# EAGLE design bisstransceiver (EAGLE 9.6.2)
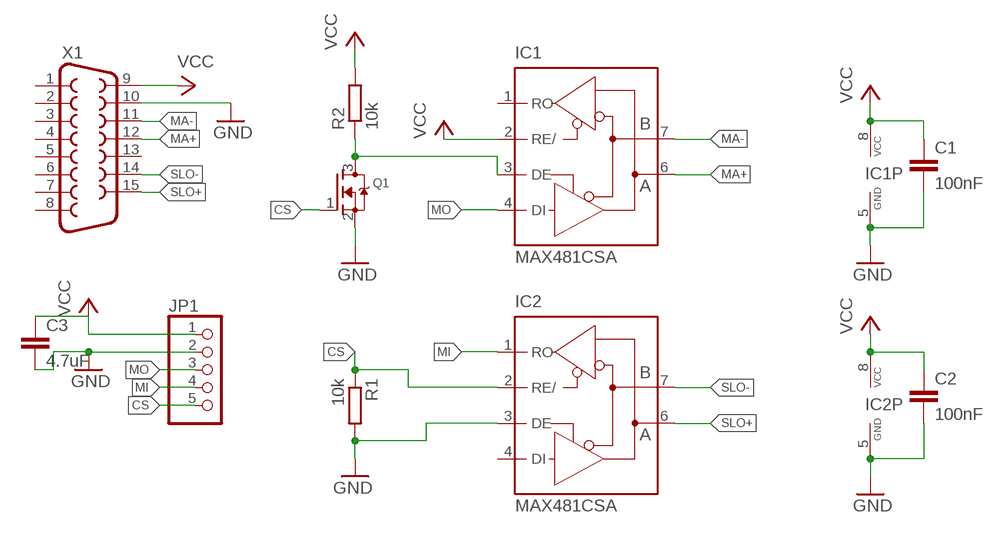
[diagram p0: schematic, sheet 1]

## Parts
C1  100nF  C-EUC0603  [C0603]
C2  100nF  C-EUC0603  [C0603]
C3  4.7uF  C-EUC0603  [C0603]
IC1  MAX481CSA  [SO08]
IC2  MAX481CSA  [SO08]
JP1  PINHD-1X5/90  [1X05/90]
Q1  MOSFET-NREFLOW  [SOT23]
R1  10k  R-EU_R0603  [R0603]
R2  10k  R-EU_R0603  [R0603]
X1  F15HP  [F15HP]

## Nets
CS: IC2.2(RE/) JP1.5 Q1.1(G) R1.1
GND: C1.2 C2.2 C3.2 IC1.5(GND) IC2.3(DE) IC2.5(GND) JP1.2 Q1.2(S) R1.2 X1.10
MA+: IC1.6(A) X1.12
MA-: IC1.7(B) X1.11
MI: IC2.1(RO) JP1.4
MO: IC1.4(DI) JP1.3
N$1: IC1.3(DE) Q1.3(D) R2.1
SLO+: IC2.6(A) X1.15
SLO-: IC2.7(B) X1.14
VCC: C1.1 C2.1 C3.1 IC1.2(RE/) IC1.8(VCC) IC2.8(VCC) JP1.1 R2.2 X1.9
Unconnected: IC1.1(RO) IC2.4(DI) X1.1 X1.2 X1.3 X1.4 X1.5 X1.6 X1.7 X1.8 X1.13

## Library data of the parts
C1-C3 = resistor:C-EU: CAPACITOR, European symbol
IC1 IC2 = maxim:MAX481CSA: RS485 TRANSEIVER; MF: MAXIM; MPN: MAX481CSA; OC_FARNELL: unknown; OC_NEWARK: 90C3817
JP1 = pinhead:PINHD-1X5: PIN HEADER
Q1 = adafruit:MOSFET-N: N-Channel Mosfet 2N7002E - 60V 260mA SOT23 [Digikey: 2N7002ET1GOSTR-ND] - REEL BSH103 - 30V 850mA SOT23 [Digikey: 568-5013-1-ND]
R1 R2 = resistor:R-EU_: RESISTOR, European symbol
X1 = con-subd:F15: SUB-D; OC_FARNELL: unknown; OC_NEWARK: unknown

## Board
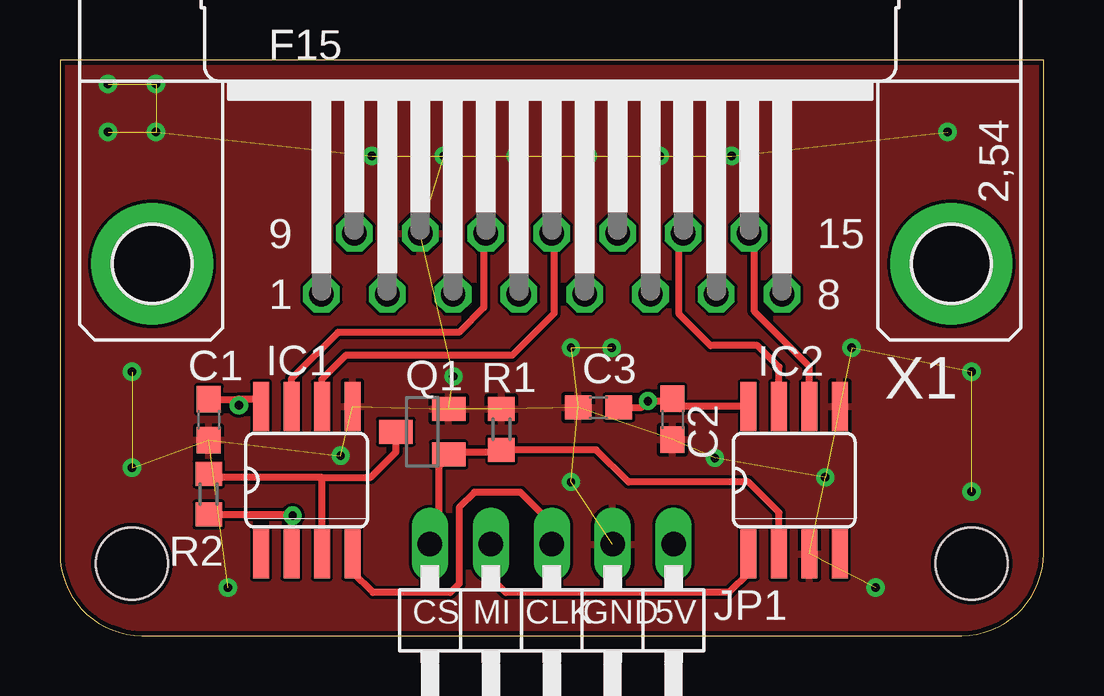
[diagram p1: board, top side]
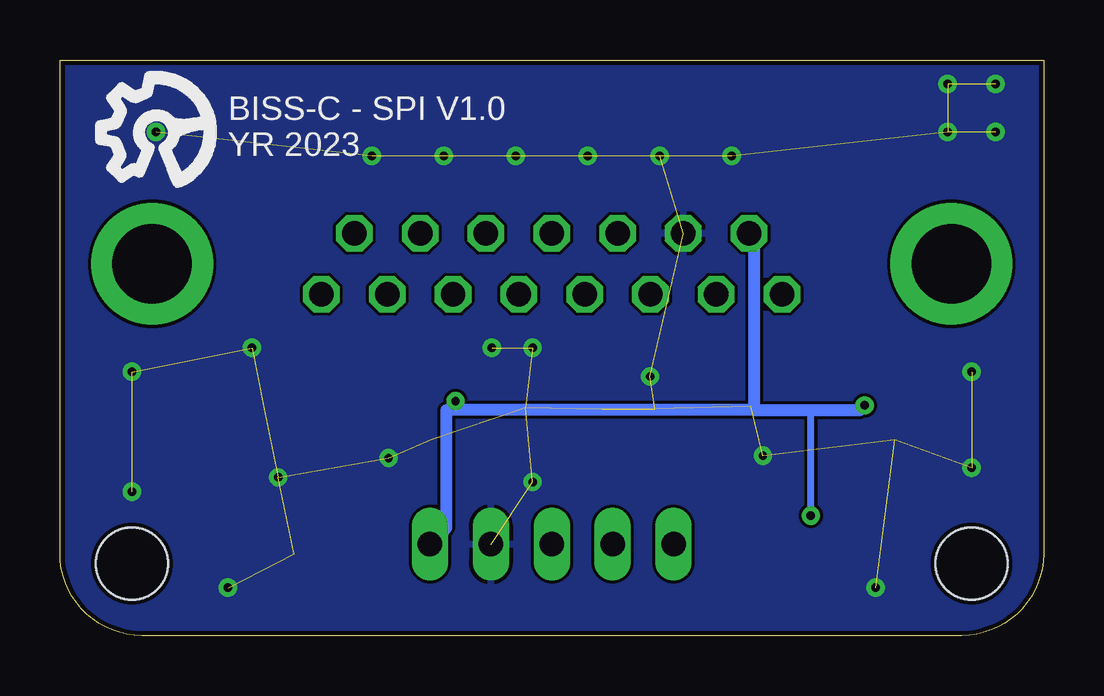
[diagram p2: board, bottom side, seen from below]

Size 41 x 24 mm. Coordinates in mm from the lower left corner, seen from the top.
Outline: 0,24 0,3.41 arc90 3.41,0 37.59,0 arc90 41,3.41 41,24 0,24
Copper layers (1*16): Top 0.035mm / dielectric 1.5mm / Bottom 0.035mm
Design rules "jlcpcb *": minimum track width 5mil, minimum drill 0.3mm, track to track 5mil, track to pad 5mil, pad to pad 5mil, via to via 5mil, smd to smd 5mil, copper to edge 0.2mm, drill to drill 8mil, minimum pad ring 10mil, minimum via ring 8mil, stop-mask expansion 4mil, vias tented up to drill 0.35mm, thermal gap 6mil
Holes 3 mm at 3,3 38,3

### Footprints (pad centres in the part's own frame; a part is rotated, then mirrored left to right if it is on the bottom)
C0603 = smd 1.1 x 1: 1 -0.85,0; 2 0.85,0
SO08 = smd 0.66 x 2.032: 1 -1.905,-3.073; 2 -0.635,-3.073; 3 0.635,-3.073; 4 1.905,-3.073; 5 1.905,3.073; 6 0.635,3.073; 7 -0.635,3.073; 8 -1.905,3.073
1X05/90 = drill 1.016 long: 1 -5.08,-3.81; 2 -2.54,-3.81; 3 0,-3.81; 4 2.54,-3.81; 5 5.08,-3.81
SOT23 = smd 1 x 1.4: 1 -0.95,-1.1; 2 0.95,-1.1; 3 0,1.1
R0603 = smd 1 x 1.1: 1 -0.85,0; 2 0.85,0
F15HP = drill 1.016 octagon: 1 -9.601,-1.27; 2 -6.858,-1.27; 3 -4.115,-1.27; 4 -1.372,-1.27; 5 1.372,-1.27; 6 4.115,-1.27; 7 6.858,-1.27; 8 9.601,-1.27; 9 -8.23,1.27; 10 -5.486,1.27; 11 -2.743,1.27; 12 0,1.27; 13 2.743,1.27; 14 5.486,1.27; 15 8.23,1.27 | drill 3.302 pad 5.08: G1 -16.662,0; G2 16.662,0

### Placement (x,y rotation side)
C1  6.2,9 270 top
C2  25.53,9.02 270 top
C3  22.45,9.51 180 top
IC1  10.29,6.48 0 top
IC2  30.61,6.48 0 top
JP1  20.5,0 180 top
Q1  15.1,8.5 90 top
R1  18.4,8.6 90 top
R2  6.2,5.9 270 top
X1  20.5,15.5 0 top

### Tracks (layer width: path | path; a pad name or v marks a point on that pad's centre or on a via)
CS
  Top 0.3: Q1.1 16.3,7.65 16.4,7.65 | 16.4,7.65 18.3,7.65 R1.1 22.35,7.75 23.7,6.4 28.7,6.4 29.97,5.13 IC2.2 | JP1.5 15.8,4.19 15.8,7.05 16.4,7.65
GND  (via drill 0.35)  (34 unrouted)
  other vias: 2,23 2,21 4,21 4,23 3,11 3,7 38,6 37,21 38,11 27.3,7.4 21.3,6.4 33,12 16.4,10.8 7,2 34,2 31.9,6.6 21.3,12 23,12 13,20 16,20 19,20 22,20 25,20 28,20 11.7,7.5
  pour Top: 0.13,26.1 0.13,-0.77 41.3,-0.77 41.3,26.1
  pour Bottom: 0.13,26.1 0.13,-0.47 41.15,-0.47 41.15,26.1
MA+
  Top 0.3: IC1.6 10.92,10.69 11.91,11.68 18.85,11.68 20.6,13.43 20.6,16.67 X1.12
MA-
  Top 0.3: IC1.7 9.65,10.71 11.58,12.64 16.63,12.64 17.66,13.67 17.66,16.67 X1.11
MI
  Top 0.3: JP1.4 17.96,2.41 18.57,1.8 27.89,1.8 28.7,2.6 IC2.1
MO
  Top 0.3: JP1.3 20.5,4.67 19.2,5.97 17.27,5.97 16.64,5.33 16.64,2.16 16.27,1.79 13.04,1.79 12.19,2.64 IC1.4
N$1
  Top 0.3: Q1.3 14,7.65 12.95,6.6 10.9,6.6 | IC1.3 10.92,6.58 10.9,6.6 | R2.1 6.35,6.6 10.9,6.6
SLO+
  Top 0.3: IC2.6 31.22,9.58 31.22,11.25 28.93,13.54 28.93,16.57 X1.15
SLO-
  Top 0.3: IC2.7 29.97,11.2 29.08,12.09 27.12,12.09 25.79,13.43 25.79,16.57 X1.14
VCC  (via drill 0.35)
  Top 0.3: IC1.8 8.06,9.87 7.46,9.87 v7.46,9.6 7.46,9.79 7.4,9.85 C1.1 | IC2.8 25.84,9.55 25.61,9.78 | 25.61,9.78 C2.1 | 25.61,9.78 v24.51,9.78 24.25,9.51 C3.1 | IC1.2 9.65,4.95 | 9.65,4.95 v9.7,5 | R2.2 9.55,5.05 9.65,4.95
  Bottom 0.3: 24.89,9.4 v24.51,9.78 | v9.7,5 9.7,9.4
  Bottom 0.5: X1.9 12.07,16.57 12.07,9.4 | v7.46,9.6 7.66,9.4 9.7,9.4 12.07,9.4 | 12.07,9.4 24.89,9.4 24.89,4.5 JP1.1

### Text on the board
tPlace: CS | MI | CLK | GND | 5V
bPlace: BISS-C - SPI V1.0 / YR 2023